# Altium schematic sheet MCU.SchDoc
size A4; SheetNumber: 2; SheetTotal: 3
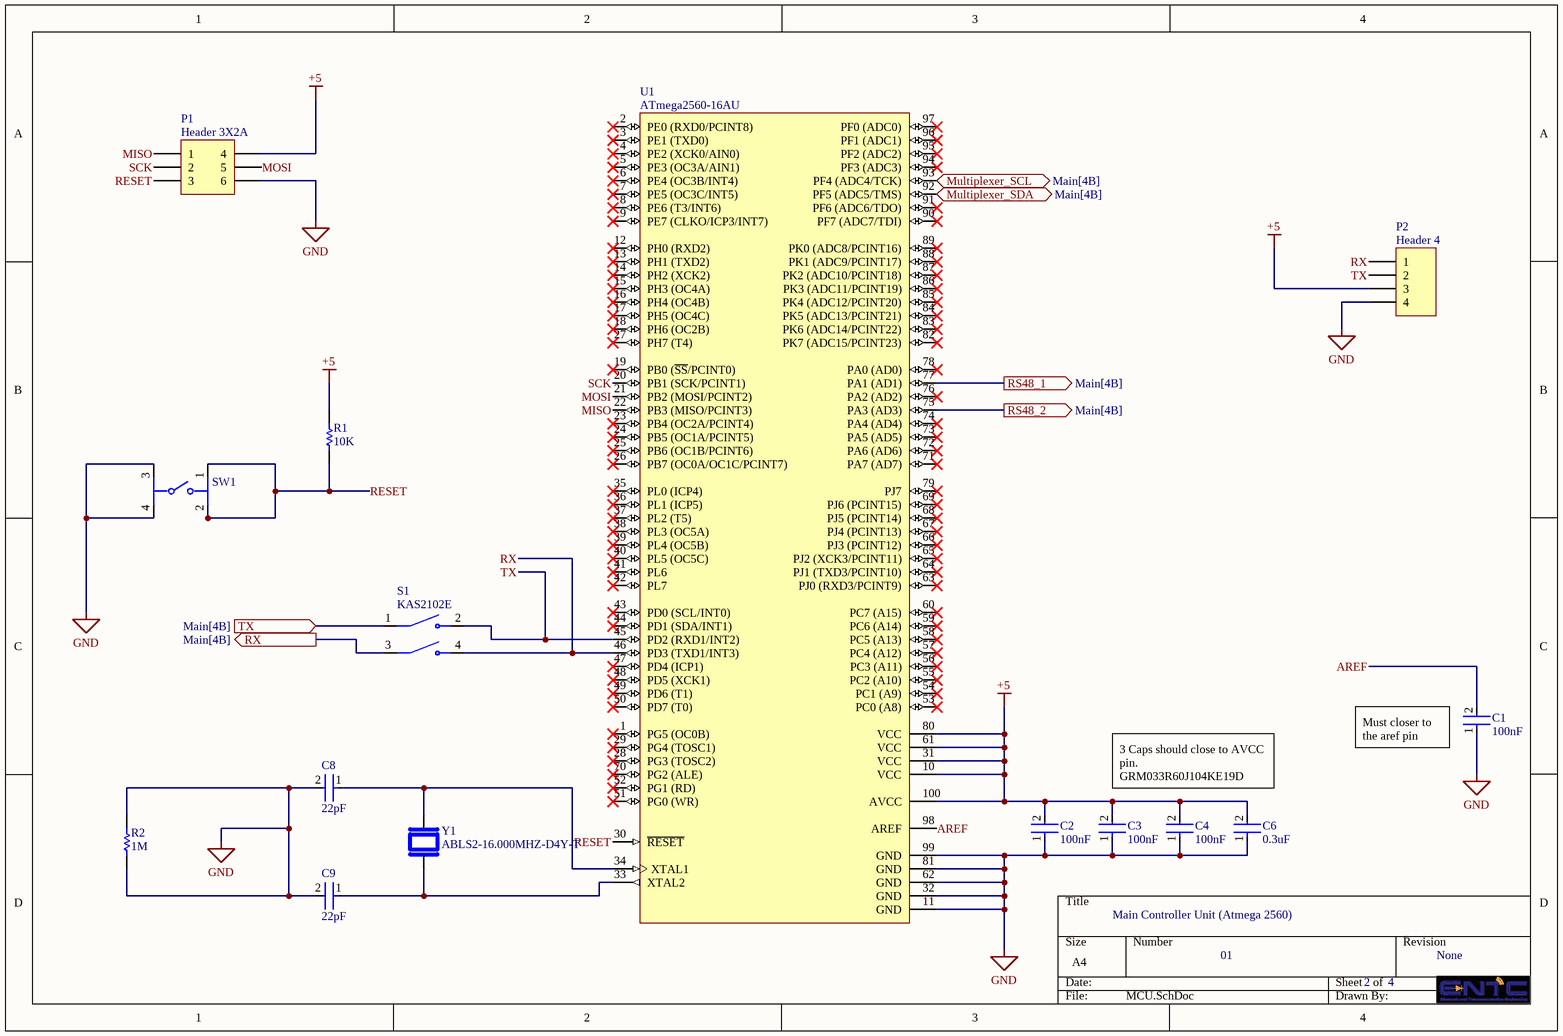
[diagram p0: MCU.SchDoc]

## Parts
C1  100nF  [FP-C1206C-EB-MFG]
C2  100nF  [FP-C1206C-EB-MFG]
C3  100nF  [FP-C1206C-EB-MFG]
C4  100nF  [FP-C1206C-EB-MFG]
C6  0.3uF  [FP-C1206C-EB-MFG]
C8  22pF  [FP-C1206C-EB-MFG]
C9  22pF  [FP-C1206C-EB-MFG]
P1  Header 3X2A  [HDR2X3_CEN]
P2  Header 4  [HDR1X4]
R1  10K  [RESC2013X60X35ML10T20]
R2  1M  [RESC2013X60X35ML10T20]
S1  KAS2102E  [SW_KAS2102E]
SW1  PTS645SM43SMTR92LFS  [FP-PTS645SM43SMTR92LFS-MFG]  (value not drawn)
U1  ATmega2560-16AU  [100A_M]
Y1  ABLS2-16.000MHZ-D4Y-T  [XTAL_ABLS2-16.000MHZ-D4Y-T]

## Ports
Multiplexer_SCL (bidir, see Main[4B]), Multiplexer_SDA (bidir, see Main[4B]), RS48_1 (out, see Main[4B]), RS48_2 (out, see Main[4B]), RX (out, see Main[4B]), TX (in, see Main[4B])

## Nets
+5: C2.2 C3.2 C4.2 C6.2 P1.4 P2.3 R1.2 U1.10(VCC) U1.31(VCC) U1.61(VCC) U1.80(VCC) U1.100(AVCC)
GND: C1.1 C2.1 C3.1 C4.1 C6.1 C8.2 C9.2 P1.6 P2.4 R2.1 R2.2 SW1.3 SW1.4 U1.11(GND) U1.32(GND) U1.62(GND) U1.81(GND) U1.99(GND)
AREF: C1.2 U1.98(AREF)
MISO: P1.1 U1.22(PB3_(MISO/PCINT3))
MOSI: P1.5 U1.21(PB2_(MOSI/PCINT2))
Multiplexer_SCL: U1.93(PF4_(ADC4/TCK)) ; port Multiplexer_SCL
Multiplexer_SDA: U1.92(PF5_(ADC5/TMS)) ; port Multiplexer_SDA
RESET: P1.3 R1.1 SW1.1 SW1.2 U1.30(~{RESET})
RS48_1: U1.77(PA1_(AD1)) ; port RS48_1
RS48_2: U1.75(PA3_(AD3)) ; port RS48_2
RX: P2.1 S1.4(NO2) U1.46(PD3_(TXD1/INT3))
RX: S1.3(COM2) ; port RX  [a separate net that carries the same name]
SCK: P1.2 U1.20(PB1_(SCK/PCINT1))
TX: P2.2 S1.2(NO1) U1.45(PD2_(RXD1/INT2))
TX: S1.1(COM1) ; port TX  [a separate net that carries the same name]
NetC8_1: C8.1 U1.34(XTAL1) Y1.2
NetC9_1: C9.1 U1.33(XTAL2) Y1.1

Not connected (* = marked no-connect by the designer): U1 1(PG5_(OC0B))* 2(PE0_(RXD0/PCINT8))* 3(PE1_(TXD0))* 4(PE2_(XCK0/AIN0))* 5(PE3_(OC3A/AIN1))* 6(PE4_(OC3B/INT4))* 7(PE5_(OC3C/INT5))* 8(PE6_(T3/INT6))* 9(PE7_(CLKO/ICP3/INT7))* 12(PH0_(RXD2))* 13(PH1_(TXD2))* 14(PH2_(XCK2))* 15(PH3_(OC4A))* 16(PH4_(OC4B))* 17(PH5_(OC4C))* 18(PH6_(OC2B))* 19(PB0_(~{SS}/PCINT0))* 23(PB4_(OC2A/PCINT4))* 24(PB5_(OC1A/PCINT5))* 25(PB6_(OC1B/PCINT6))* 26(PB7_(OC0A/OC1C/PCINT7))* 27(PH7_(T4))* 28(PG3_(TOSC2))* 29(PG4_(TOSC1))* 35(PL0_(ICP4))* 36(PL1_(ICP5))* 37(PL2_(T5))* 38(PL3_(OC5A))* 39(PL4_(OC5B))* 40(PL5_(OC5C))* 41(PL6)* 42(PL7)* 43(PD0_(SCL/INT0))* 44(PD1_(SDA/INT1))* 47(PD4_(ICP1))* 48(PD5_(XCK1))* 49(PD6_(T1))* 50(PD7_(T0))* 51(PG0_(WR))* 52(PG1_(RD))* 53(PC0_(A8))* 54(PC1_(A9))* 55(PC2_(A10))* 56(PC3_(A11))* 57(PC4_(A12))* 58(PC5_(A13))* 59(PC6_(A14))* 60(PC7_(A15))* 63(PJ0_(RXD3/PCINT9))* 64(PJ1_(TXD3/PCINT10))* 65(PJ2_(XCK3/PCINT11))* 66(PJ3_(PCINT12))* 67(PJ4_(PCINT13))* 68(PJ5_(PCINT14))* 69(PJ6_(PCINT15))* 70(PG2_(ALE))* 71(PA7_(AD7))* 72(PA6_(AD6))* 73(PA5_(AD5))* 74(PA4_(AD4))* 76(PA2_(AD2))* 78(PA0_(AD0))* 79(PJ7)* 82(PK7_(ADC15/PCINT23))* 83(PK6_(ADC14/PCINT22))* 84(PK5_(ADC13/PCINT21))* 85(PK4_(ADC12/PCINT20))* 86(PK3_(ADC11/PCINT19))* 87(PK2_(ADC10/PCINT18))* 88(PK1_(ADC9/PCINT17))* 89(PK0_(ADC8/PCINT16))* 90(PF7_(ADC7/TDI))* 91(PF6_(ADC6/TDO))* 94(PF3_(ADC3))* 95(PF2_(ADC2))* 96(PF1_(ADC1))* 97(PF0_(ADC0))*

## Notes on the sheet
- 3 Caps should close to AVCC pin.
  GRM033R60J104KE19D
- (near C1) Must closer to the aref pin
- Main Controller Unit (Atmega 2560)
- 01
- 2
- 4
- None

## Library data of the parts
C1-C4 C6 C8 C9 = CMP-1037-04222-2: CAP CER 0.1UF 200V 10% X7R 1206; Manufacturer Part Number: C1206C104K2RACTU; Manufacturer: KEMET; Automotive Grade: Grade 0; Tolerance: 0.1; Value: 0.10 μF; Material: Ceramic; Temperature Coefficient: 15%; Automotive: Yes; Temperature Characteristic: X7R; Digikey Description: CAP CER 0.1UF 200V 10% X7R 1206; ComponentLink2URL: https://content.kemet.com/datasheets/KEM_C1007_X8R_ULTRA_150C_SMD.pdf; Voltage Rating: 200 V; Temperature Range High: +150°C; Device Class L1: Passive Components; Octopart: https://octopart.com/c1206c104k2ractu-kemet-9138344; Temperature: -55°C to +150°C; Height: 0.88mm; Device Class L3: Ceramic Capacitors; Lead Free: Yes; Package: C1206C-EB; Category: Cap; Temperature Range Low: -55°C; Mouser Description: Multilayer Ceramic Capacitors MLCC - SMD/SMT 200volts 0.1uF X7R 10%; Ipc Land Pattern Name: CAPC320160X78; Capacitance: 0.10 μF; RoHS: TRUE; ComponentLink2Description: Datasheet; Device Class L2: Capacitors
P1 = Header 3X2A: Header, 3-Pin, Dual row; LatestRevisionDate: 17-Jul-2002; LatestRevisionNote: Re-released for DXP Platform.; Publisher: Altium Limited
P2 = Header 4: Header, 4-Pin; LatestRevisionDate: 17-Jul-2002; LatestRevisionNote: Re-released for DXP Platform.; Publisher: Altium Limited
R1 R2 = CMP-2100-03673-1: Chip Resistor, 0 Ohm, Jumper, +/- 5%, 0.125 W, -55 to 155 degC, 0805 (2012 Metric), RoHS, Tape and Reel; Manufacturer: Yageo; Power Rating: 125mW; Resistance: 0mOhm; Voltage Rating (DC): 150V; Temperature Coefficient: 200ppm/degreesC; Height: 0.5mm; Depth: 1.25mm; Case Code (Imperial): 0805; Lead Free: LeadFree; Military Standard: Not; Package Description: 2-Pin Surface Mounted Device, Body 2 x 1.25 mm; Case Code (Metric): 2012; Composition: ThickFilm; Voltage Rating: 150V; Manufacturer URL: http://www.yageo.com/; Packaging: TapeandReel; Package Reference: 0805; REACH SVHC: Unknown; Tolerance: 5%; Case/Package: 0805; Max Operating Temperature: 155degC; Number of Pins: 2; Min Operating Temperature: -55degC; RoHSCompliant: true; Length: 2mm; Datasheet URL: http://www.yageo.com/NewPortal/yageodocoutput?fileName=/pdf/R-Chip/PYu-RC_Group_51_RoHS_L_5.pdf; Termination: SMD/SMT; Radiation Hardening: No; Width: 1.25mm; Contact Plating: Tin; Datasheet Version: Rev. 5, 10/2016
SW1 = CMP-2000-05160-2: SWITCH TACTILE SPST-NO 0.05A 12V; Contact Resistance: 100mR; Throw Configuration: SPST; Illumination Type: Non-Illuminated; Mechanical Life: 100000Cycles; Current Rating: 50mA; Switch Function: Off-Mom; Actuator Length: 0.85mm; Actuator Material: Nylon; Actuator Type: Standard; Operating Force: 160gf; Min Operating Temperature: -20°C; REACH SVHC: No SVHC; Termination: Gull Wing; Case/Package: SMD/SMT; Packaging: Tape and Reel; Mount: Surface Mount; Voltage Rating (DC): 12V; Orientation: Straight; Lead Free: Lead Free; Contact Material: Silver; Color: Black; Max Current Rating: 50mA; Contact Plating: Silver; Depth: 9mm; Package Quantity: 1; Max Voltage Rating (DC): 12V; Length: 6mm; Max Operating Temperature: 60°C
U1 = CMP-0095-00210-2: 8-bit AVR Microcontroller, 4.5-5.5V, 16MHz, 256KB Flash, 4KB EEPROM, 8KB SRAM, 86 GPIO pins, 100-pin TQFP, Industrial Grade (-40°C to 85°C), Pb-Free; PackageDescription: 100-Pin Thin Profile Plastic Quad Flat Pack (TQFP), 14 x 14 x 1.0 mm Body, 0.5 mm Pitch; ComponentLink1Description: Manufacturer URL; ComponentLink3URL: http://www.atmel.com/dyn/resources/prod_documents/2549S.pdf; RevisionNote: DatasheetVersion & PackageVersion updated. URLs added.; DatasheetVersion: revN, May-2011; ComponentLink2Description: ATmega640/1280/1281/2560/2561 Datasheet; PackageReference: 100A; PackageVersion: revD, Oct-2010; Code_JEDEC: MS-026-AED; ComponentLink1URL: http://www.atmel.com/; ComponentLink2URL: http://www.atmel.com/dyn/resources/prod_documents/doc2549.pdf; ComponentLink3Description: ATmega640/1280/1281/2560/2561 Summary
Y1 = ABLS2-16.000MHZ-D4Y-T: HC/49US (AT49) LOW PROFILE SURFACE MOUNT MICROPROCESSOR CRYSTAL; MF: Abracon; Check_prices: https://www.snapeda.com/parts/ABLS2-16.000MHZ-D4Y-T/Abracon+LLC/view-part/?ref=eda; Package: HC49/US Abracon; Price: None; Value: *; MP: ABLS2-16.000MHZ-D4Y-T; Purchase-URL: https://pricing.snapeda.com/search/part/ABLS2-16.000MHZ-D4Y-T/?ref=eda; Availability: In Stock; SnapEDA_Link: https://www.snapeda.com/parts/ABLS2-16.000MHZ-D4Y-T/Abracon+LLC/view-part/?ref=snap
S1 = KAS2102E: MP: KAS2102E; Availability: Unavailable; Package: None; Price: None; Value: *